# EAGLE design pico-v3 (EAGLE 9.6.2)
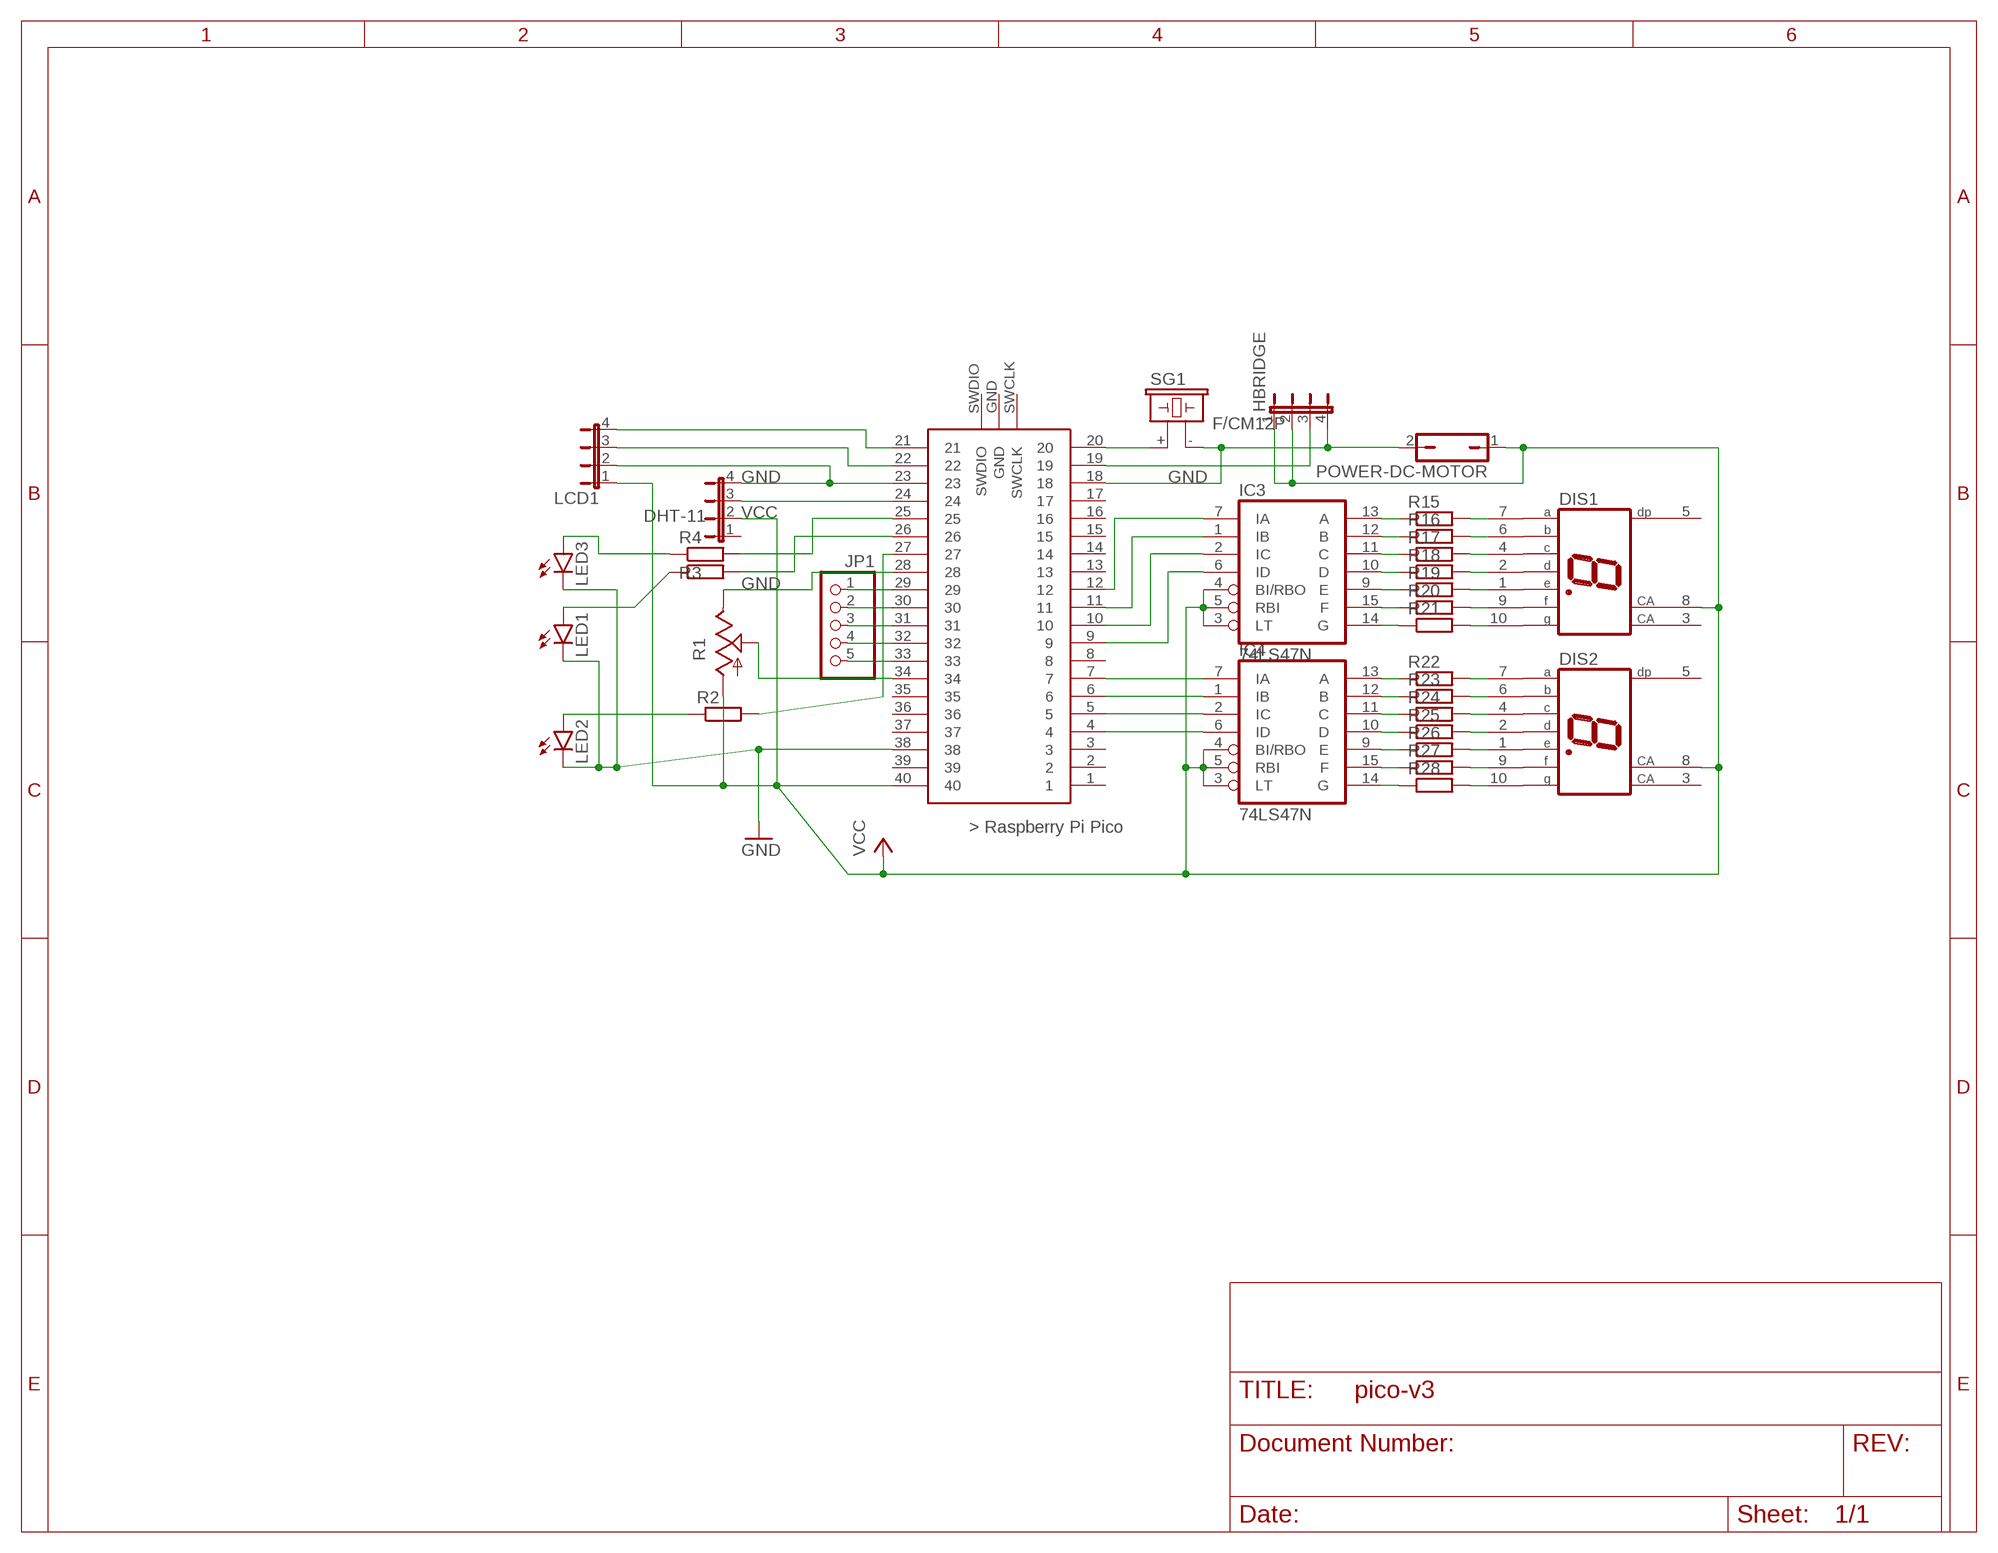
[diagram p0: schematic, sheet 1]

## Parts
DHT-11  JP4E  [JP4]
DIS1  HD-H101  [HDSP-M]
DIS2  HD-H101  [HDSP-M]
HBRIDGE  JP4E  [JP4]
IC3  74LS47N  [DIL16]
IC4  74LS47N  [DIL16]
JP1  PINHD-1X5  [1X05]
LCD1  JP4E  [JP4]
LED1  LED5MM  [LED5MM]
LED2  LED5MM  [LED5MM]
LED3  LED5MM  [LED5MM]
POWER-DC-MOTOR  JP1Q  [JP1]
R1  TRIM_US-CA6V  [CA6V]
R2  R-EU_0207/10  [0207/10]
R3  R-EU_0207/10  [0207/10]
R4  R-EU_0207/10  [0207/10]
R15  R-EU_0207/12  [0207/12]
R16  R-EU_0207/12  [0207/12]
R17  R-EU_0207/12  [0207/12]
R18  R-EU_0207/12  [0207/12]
R19  R-EU_0207/12  [0207/12]
R20  R-EU_0207/12  [0207/12]
R21  R-EU_0207/12  [0207/12]
R22  R-EU_0207/12  [0207/12]
R23  R-EU_0207/12  [0207/12]
R24  R-EU_0207/12  [0207/12]
R25  R-EU_0207/12  [0207/12]
R26  R-EU_0207/12  [0207/12]
R27  R-EU_0207/12  [0207/12]
R28  R-EU_0207/12  [0207/12]
SG1  F/CM12P  [F/CM12P]
U$1  RASPBERRY-PI-PICO_TH  [FT_RASPBERRY-PI-PICO_TH]

## Nets
GND: DHT-11.4 HBRIDGE.4 LCD1.2 LED1.K(C) LED2.K(C) LED3.K(C) POWER-DC-MOTOR.2 R1.E SG1.- U$1.18 U$1.23 U$1.28 U$1.38
N$1: IC4.7(IA) U$1.7
N$2: IC4.1(IB) U$1.6
N$3: IC4.2(IC) U$1.5
N$4: IC4.6(ID) U$1.4
N$5: R1.S U$1.34
N$6: IC3.14(G) R21.1
N$7: DIS2.7(A) R22.2
N$8: DIS2.6(B) R23.2
N$9: DIS2.4(C) R24.2
N$10: DIS2.2(D) R25.2
N$11: DIS2.1(E) R26.2
N$12: DIS1.10(G) R21.2
N$14: IC3.6(ID) U$1.9
N$15: IC3.2(IC) U$1.10
N$16: IC3.1(IB) U$1.11
N$17: IC3.7(IA) U$1.12
N$18: DIS2.9(F) R27.2
N$19: DIS2.10(G) R28.2
N$20: IC4.13(A) R22.1
N$21: IC4.12(B) R23.1
N$22: IC4.11(C) R24.1
N$23: DIS1.7(A) R15.2
N$24: DIS1.6(B) R16.2
N$25: DIS1.4(C) R17.2
N$26: DIS1.2(D) R18.2
N$27: DIS1.1(E) R19.2
N$28: JP1.1 U$1.29
N$29: JP1.2 U$1.30
N$30: IC4.10(D) R25.1
N$31: IC4.9(E) R26.1
N$32: IC4.15(F) R27.1
N$33: IC4.14(G) R28.1
N$34: SG1.+ U$1.20
N$35: JP1.3 U$1.31
N$36: DIS1.9(F) R20.2
N$37: IC3.13(A) R15.1
N$38: IC3.12(B) R16.1
N$39: IC3.11(C) R17.1
N$40: IC3.10(D) R18.1
N$41: IC3.9(E) R19.1
N$42: IC3.15(F) R20.1
N$43: HBRIDGE.3 U$1.19
N$44: JP1.4 U$1.32
N$45: DHT-11.3 U$1.24
N$46: LCD1.4 U$1.21
N$47: LCD1.3 U$1.22
N$48: JP1.5 U$1.33
N$51: R2.2 U$1.27
N$52: R4.2 U$1.25
N$53: R3.2 U$1.26
N$54: LED2.A R2.1
N$55: LED1.A R3.1
N$56: LED3.A R4.1
VCC [New Class]: DHT-11.2 DIS1.8(CA) DIS2.8(CA) HBRIDGE.1 HBRIDGE.2 IC3.3(LT) IC3.4(BI/RBO) IC3.5(RBI) IC4.3(LT) IC4.4(BI/RBO) IC4.5(RBI) LCD1.1 POWER-DC-MOTOR.1 R1.A U$1.40
Unconnected: DHT-11.1 DIS1.3(CA) DIS1.5(DP) DIS2.3(CA) DIS2.5(DP) U$1.1 U$1.2 U$1.3 U$1.8 U$1.13 U$1.14 U$1.15 U$1.16 U$1.17 U$1.35 U$1.36 U$1.37 U$1.39 U$1.GND U$1.SWCLK U$1.SWDIO

## Power pins joined to a net without a drawn wire
GND: IC3.8(GND) IC4.8(GND)
VCC: IC3.16(VCC) IC4.16(VCC)

## Library data of the parts
DHT-11 HBRIDGE LCD1 = jumper:JP4E: JUMPER
DIS1 DIS2 = display-hp:HD-H101: LED DISPLAY 1-character 7 segment, decimal point right; OC_FARNELL: unknown; OC_NEWARK: unknown
IC3 IC4 = 74xx-eu:74*47: BCD to seven segment DECODER/DRIVER Source: http://www.ee.washington.edu/stores/DataSheets/74ls/74ls47.pdf
JP1 = pinhead:PINHD-1X5: PIN HEADER
LED1-LED3 = led:LED: LED OSRAM: - CHIPLED LG R971, LG N971, LY N971, LG Q971, LY Q971, LO R971, LY R971 LH N974, LH R974 LS Q976, LO Q976, LY Q976 LO Q996 - Hyper CHIPLED LW Q18S LB Q993, LB Q99A, LB R99A - SideLED LS A670, LO A670, LY A670, LG A670, LP A670 LB A673, LV A673, LT A673, LW A673 LH A674 LY A675 LS A676, LA A676, LO A676, LY A676, LW A676 LS A679, LY A679, LG A679 - Hyper Micro SIDELED® LS Y876, LA Y876, LO Y876, LY Y876 LT Y87S - SmartLED LW L88C, LW L88S LB L89C, LB L89S, LG L890 LS L89K, LO L89K, LY L89K LS L896, LA L896, LO L896, LY L896 - TOPLED LS T670, LO T670, LY T670, LG T670, LP T670 LSG T670, LSP T670, LSY T670, LOP T670, LYG T670 LG T671, LOG T671, LSG T671 LB T673, LV T673, LT T673, LW T673 LH T674 LS T676, LA T676, LO T676, LY T676, LB T676, LH T676, LSB T676, LW T676 LB T67C, LV T67C, LT T67C, LS T67K, LO T67K, LY T67K, LW E67C LS E67B, LA E67B, LO E67B, LY E67B, LB E67C, LV E67C, LT E67C LW T67C LS T679, LY T679, LG T679 LS T770, LO T770, LY T770, LG T770, LP T770 LB T773, LV T773, LT T773, LW T773 LH T774 LS E675, LA E675, LY E675, LS T675 LS T776, LA T776, LO T776, LY T776, LB T776 LHGB T686 LT T68C, LB T68C - Hyper Mini TOPLED® LB M676 - Mini TOPLED Santana® LG M470 LS M47K, LO M47K, LY M47K Source: http://www.osram.convergy.de LUXEON: - LUMILED® LXK2-PW12-R00, LXK2-PW12-S00, LXK2-PW14-U00, LXK2-PW14-V00 LXK2-PM12-R00, LXK2-PM12-S00, LXK2-PM14-U00 LXK2-PE12-Q00, LXK2-PE12-R00, LXK2-PE12-S00, LXK2-PE14-T00, LXK2-PE14-U00 LXK2-PB12-K00, LXK2-PB12-L00, LXK2-PB12-M00, LXK2-PB14-N00, LXK2-PB14-P00, LXK2-PB14-Q00 LXK2-PR12-L00, LXK2-PR12-M00, LXK2-PR14-Q00, LXK2-PR14-R00 LXK2-PD12-Q00, LXK2-PD12-R00, LXK2-PD12-S00 LXK2-PH12-R00, LXK2-PH12-S00 LXK2-PL12-P00, LXK2-PL12-Q00, LXK2-PL12-R00 Source: www.luxeon.com KINGBRIGHT: KA-3528ASYC Source: www.kingbright.com
POWER-DC-MOTOR = jumper:JP1Q: JUMPER
R1 = pot:TRIM_US-: POTENTIOMETER
R2-R4 R15-R28 = rcl:R-EU_: RESISTOR, European symbol; SPICEPREFIX: R
SG1 = buzzer:F/CM12P: BUZZER Source: Buerklin; OC_FARNELL: unknown; OC_NEWARK: unknown
U$1 = pipico:RASPBERRY-PI-PICO_TH: Raspberry Pi Pico microcontroller board for through-hole mounting.

## Board
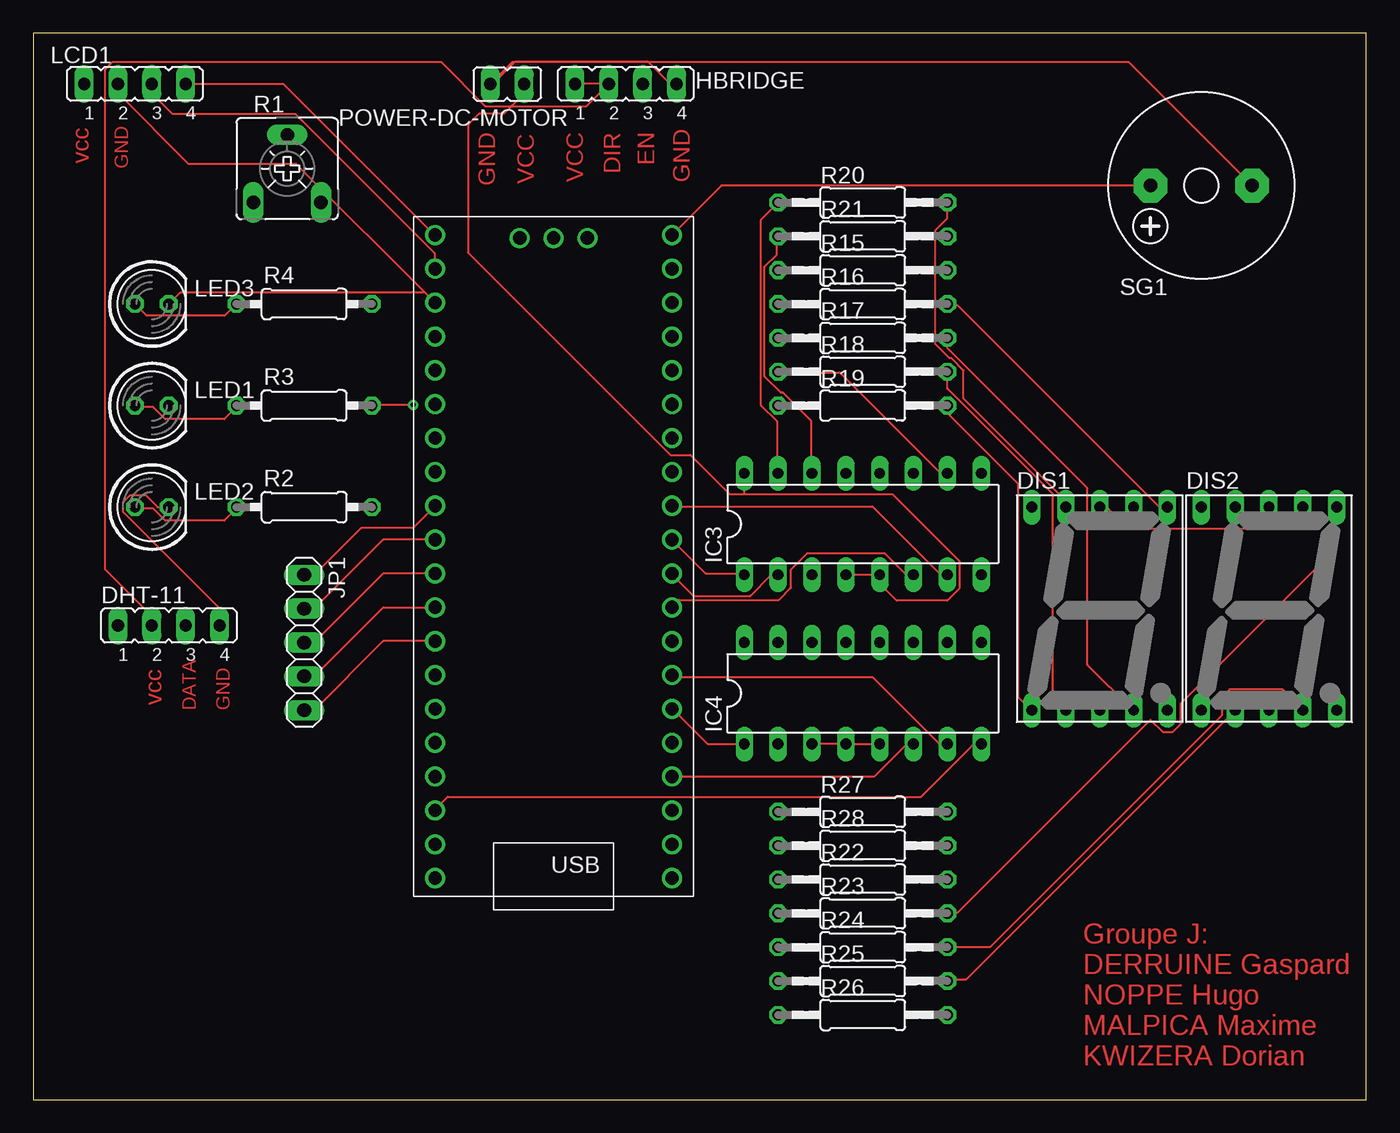
[diagram p1: board, top side]
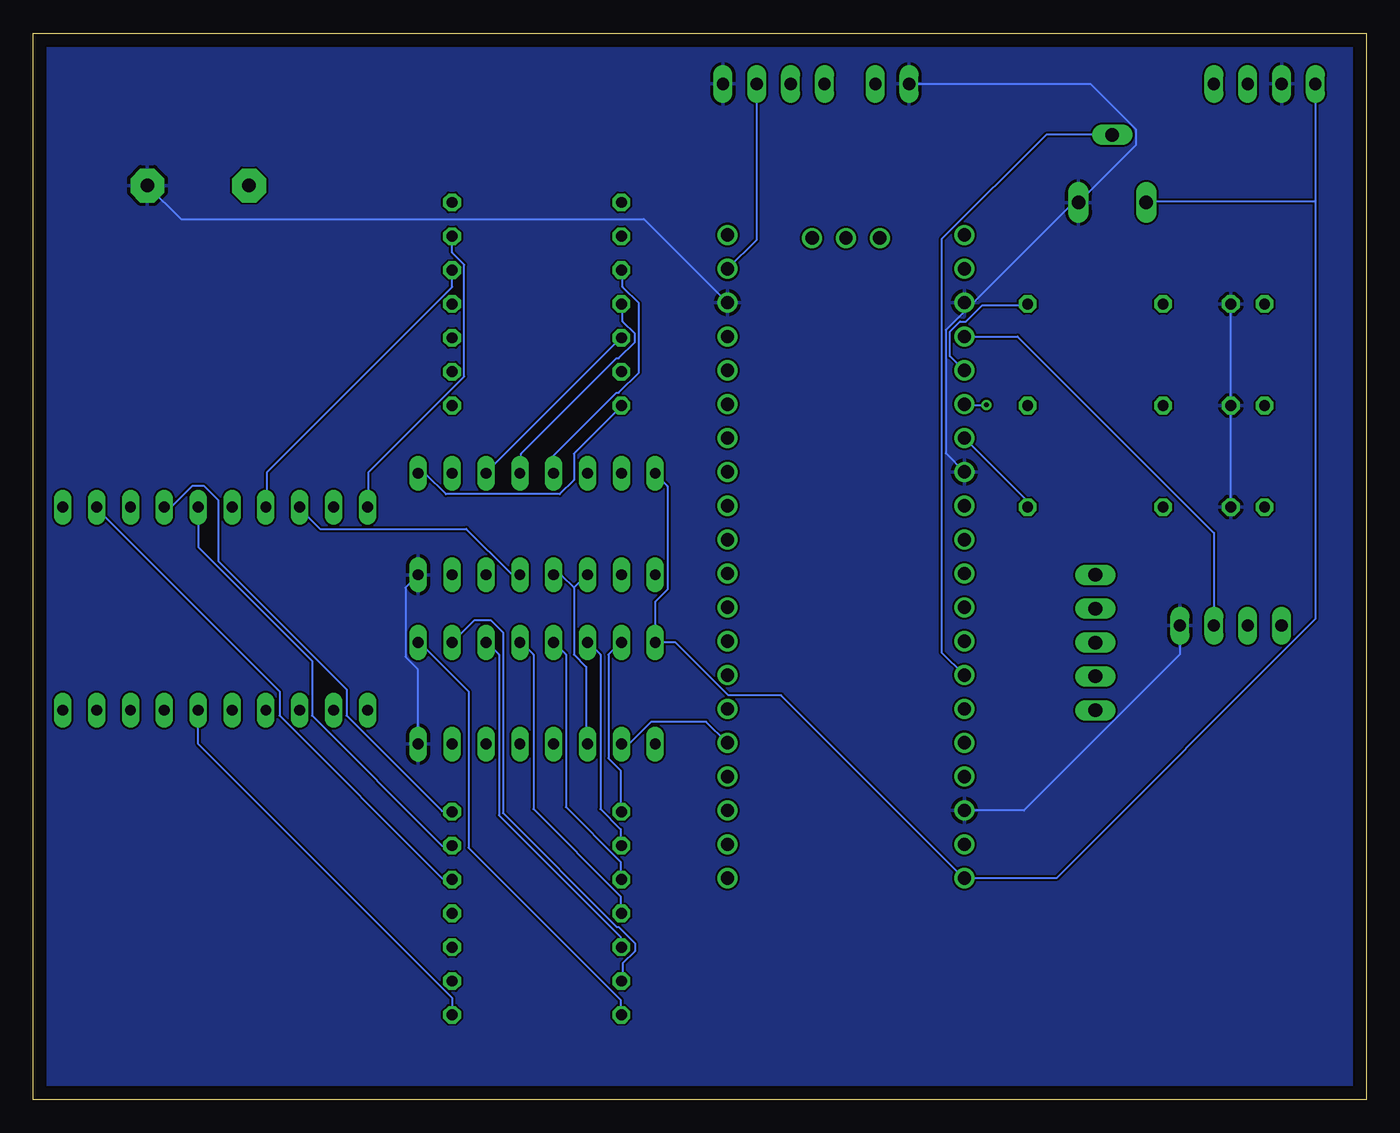
[diagram p2: board, bottom side, seen from below]

Size 100 x 80 mm. Coordinates in mm from the lower left corner, seen from the top.
Outline: 0,0 100,0 100,80 0,80 0,0
Copper layers (1*16): Top 0.035mm / dielectric 1.5mm / Bottom 0.035mm
Design rules "default": minimum track width 6mil, minimum drill 0.35mm, track to track 6mil, track to pad 6mil, pad to pad 6mil, via to via 6mil, smd to smd 6mil, copper to edge 40mil, drill to drill 6mil, minimum pad ring 10mil, minimum via ring 8mil, stop-mask expansion 4mil, vias tented up to drill 0mil, thermal gap 10mil

### Footprints (pad centres in the part's own frame; a part is rotated, then mirrored left to right if it is on the bottom)
JP4 = drill 0.914 long: 1 -3.81,0; 2 -1.27,0; 3 1.27,0; 4 3.81,0
HDSP-M = drill 0.813 long: 1 -5.08,-7.62; 2 -2.54,-7.62; 3 0,-7.62; 4 2.54,-7.62; 5 5.08,-7.62; 6 5.08,7.62; 7 2.54,7.62; 8 0,7.62; 9 -2.54,7.62; 10 -5.08,7.62
DIL16 = drill 0.813 long: 1 -8.89,-3.81; 2 -6.35,-3.81; 3 -3.81,-3.81; 4 -1.27,-3.81; 5 1.27,-3.81; 6 3.81,-3.81; 7 6.35,-3.81; 8 8.89,-3.81; 9 8.89,3.81; 10 6.35,3.81; 11 3.81,3.81; 12 1.27,3.81; 13 -1.27,3.81; 14 -3.81,3.81; 15 -6.35,3.81; 16 -8.89,3.81
1X05 = drill 1.016 long: 1 -5.08,0; 2 -2.54,0; 3 0,0; 4 2.54,0; 5 5.08,0
LED5MM = drill 0.813 octagon: A -1.27,0; K 1.27,0
JP1 = drill 0.914 long: 1 0,-1.27; 2 0,1.27
CA6V = drill 1.016 long: A -2.54,-2.54; E 2.54,-2.54; S 0,2.54
0207/10 = drill 0.813 octagon: 1 -5.08,0; 2 5.08,0
0207/12 = drill 0.813 octagon: 1 -6.35,0; 2 6.35,0
F/CM12P = drill 1.016 pad 2.54 octagon: + 3.81,0; - -3.81,0
FT_RASPBERRY-PI-PICO_TH = drill 1: 1 -8.55,24.03; 2 -8.55,21.49; 3 -8.55,18.95; 4 -8.55,16.41; 5 -8.55,13.87; 6 -8.55,11.33; 7 -8.55,8.79; 8 -8.55,6.25; 9 -8.55,3.71; 10 -8.55,1.17; 11 -8.55,-1.37; 12 -8.55,-3.91; 13 -8.55,-6.45; 14 -8.55,-8.99; 15 -8.55,-11.53; 16 -8.55,-14.07; 17 -8.55,-16.61; 18 -8.55,-19.15; 19 -8.55,-21.69; 20 -8.55,-24.23; 21 9.23,-24.23; 22 9.23,-21.69; 23 9.23,-19.15; 24 9.23,-16.61; 25 9.23,-14.07; 26 9.23,-11.53; 27 9.23,-8.99; 28 9.23,-6.45; 29 9.23,-3.91; 30 9.23,-1.37; 31 9.23,1.17; 32 9.23,3.71; 33 9.23,6.25; 34 9.23,8.79; 35 9.23,11.33; 36 9.23,13.87; 37 9.23,16.41; 38 9.23,18.95; 39 9.23,21.49; 40 9.23,24.03; GND 0.34,-24; SWCLK -2.2,-24; SWDIO 2.88,-24

### Placement (x,y rotation side)
DHT-11  10.16,35.56 0 top
DIS1  80.01,36.83 0 top
DIS2  92.71,36.83 0 top
HBRIDGE  44.45,76.2 0 top
IC3  62.23,43.18 0 top
IC4  62.23,30.48 0 top
JP1  20.32,34.29 270 top
LCD1  7.62,76.2 0 top
LED1  8.89,52.07 0 top
LED2  8.89,44.45 0 top
LED3  8.89,59.69 0 top
POWER-DC-MOTOR  35.56,76.2 90 top
R1  19.05,69.85 0 top
R2  20.32,44.45 0 top
R3  20.32,52.07 0 top
R4  20.32,59.69 0 top
R15  62.23,62.23 0 top
R16  62.23,59.69 0 top
R17  62.23,57.15 0 top
R18  62.23,54.61 0 top
R19  62.23,52.07 0 top
R20  62.23,67.31 0 top
R21  62.23,64.77 0 top
R22  62.23,16.51 0 top
R23  62.23,13.97 0 top
R24  62.23,11.43 0 top
R25  62.23,8.89 0 top
R26  62.23,6.35 0 top
R27  62.23,21.59 0 top
R28  62.23,19.05 0 top
SG1  87.63,68.58 180 top
U$1  39.37,40.64 180 top

### Tracks (layer width: path | path; a pad name or v marks a point on that pad's centre or on a via)
GND
  Top 0.152: IC4.8 70.56,26.67 66.6,22.71 31.09,22.71 30.18,21.79 U$1.38 | LED2.K 9.32,44.45 8.43,45.34 7.25,45.34 6.73,44.82 6.73,44.08 13.97,36.84 DHT-11.4 | HBRIDGE.4 47.76,76.2 46.11,77.85 36.13,77.85 34.48,76.2 POWER-DC-MOTOR.2 35.94,77.85 82.17,77.85 SG1.- | LCD1.2 6.35,75.49 11.61,70.23 19.7,70.23 U$1.23 29.35,60.58 11.05,60.58 LED3.K
  Bottom 0.152: IC3.8 72.08,38.41 72.08,33.22 71.17,32.31 71.17,26.67 IC4.8 | LED2.K 10.21,44.5 10.21,51.97 LED1.K LED3.K | SG1.- 88.92,66.06 54.19,66.06 U$1.18 | POWER-DC-MOTOR.2 20.7,76.2 17.3,72.8 17.3,71.6 R1.E 21.97,67.31 29.82,59.46 | U$1.28 31.55,48.5 31.55,57.73 29.82,59.46 | 29.82,59.46 30.1,59.74 U$1.23 | DHT-11.4 13.97,34.85 13.97,33.4 25.68,21.69 U$1.38
  pour Bottom (isolate 0.021): 0,80.01 100.33,80.01 100.33,0 0,0
N$1
  Top 0.152: IC4.7 67.97,26.67 62.94,31.7 48.01,31.7 U$1.7
N$2
  Top 0.152: IC4.1 50.6,26.67 48.01,29.26 U$1.6
N$3
  Bottom 0.152: IC4.2 55.32,26.67 53.65,28.35 49.53,28.35 48.01,26.82 U$1.5
N$4
  Top 0.152: IC4.6 65.53,26.67 63.09,24.23 48.01,24.23 U$1.4
N$5
  Bottom 0.152: R1.S 24.01,72.39 31.85,64.55 31.85,33.56 U$1.34
N$6
  Top 0.152: R21.1 55.78,64.77 55.78,63.4 54.86,62.48 54.86,54.25 56.08,53.03 56.24,53.03 58.37,50.9 58.37,47.09 IC3.14
N$7
  Bottom 0.152: R22.2 68.58,16.61 69.34,16.61 81.53,28.8 81.53,30.63 95.25,44.35 DIS2.7
N$8
  Top 0.152: DIS2.6 97.69,44.35 97.69,41.3 86.11,29.72 86.11,28.19 85.5,27.58 84.73,27.58 83.82,28.5 69.34,14.02 68.63,14.02 R23.2
N$9
  Top 0.152: R24.2 71.78,11.43 89.15,28.8 89.15,30.18 89.76,30.79 93.73,30.79 95.25,29.26 DIS2.4
N$10
  Top 0.152: R25.2 68.58,8.99 69.95,8.99 DIS2.2
N$11
  Bottom 0.152: R26.2 68.58,7.62 87.63,26.67 DIS2.1
N$12
  Bottom 0.152: R21.2 68.58,63.55 67.67,62.64 67.67,54.25 74.83,47.09 74.83,44.5 DIS1.10
N$14
  Top 0.152: IC3.6 65.99,39.47 65.38,39.47 63.86,41 58.06,41 56.84,39.78 56.84,38.41 55.93,37.49 48.46,37.49 48.01,37.03 U$1.9
N$15
  Top 0.152: IC3.2 55.78,39.32 55.32,39.32 53.8,37.8 49.53,37.8 48.01,39.32 U$1.10
N$16
  Top 0.152: IC3.1 53.34,39.47 50.44,39.47 48.01,41.91 U$1.11
N$17
  Top 0.152: IC3.7 68.58,39.47 67.97,39.47 62.94,44.5 48.01,44.5 U$1.12
N$18
  Bottom 0.152: R27.2 68.58,21.64 69.34,21.64 76.5,28.8 76.5,30.79 86.11,40.39 86.11,44.96 87.17,46.02 88.09,46.02 89.61,44.5 90.07,44.5 DIS2.9
N$19
  Bottom 0.152: R28.2 69.34,19.05 79.1,28.8 79.1,32.92 87.63,41.45 DIS2.10
N$20
  Bottom 0.152: IC4.13 60.05,33.38 60.05,21.95 55.93,17.83 55.93,16.61 R22.1
N$21
  Bottom 0.152: R23.1 55.93,14.02 55.93,15.24 62.48,21.79 62.48,33.38 63.4,34.29 IC4.12
N$22
  Bottom 0.152: R24.1 55.93,11.43 55.93,12.19 65.08,21.34 65.08,33.38 65.99,34.29 IC4.11
N$23
  Bottom 0.152: R15.2 68.58,60.96 82.45,47.09 82.45,44.5 DIS1.7
N$24
  Top 0.152: R16.2 68.58,59.59 69.34,59.59 84.43,44.5 85.04,44.5 DIS1.6
N$25
  Top 0.152: R17.2 68.58,56.39 79.1,45.87 79.1,32.61 82.45,29.26 DIS1.4
N$26
  Top 0.152: R18.2 68.58,53.34 76.5,45.41 76.5,30.18 DIS1.2
N$27
  Top 0.152: R19.2 68.58,51.51 73.91,46.18 73.91,30.18 74.83,29.26 DIS1.1
N$28
  Top 0.152: U$1.29 28.49,42.9 24.61,42.9 21.08,39.37 JP1.1
N$29
  Top 0.152: U$1.30 26.26,42.01 21.08,36.83 JP1.2
N$30
  Bottom 0.152: IC4.10 66.9,35.97 65.68,35.97 64.77,35.05 64.77,21.49 56.24,12.95 56.08,12.95 54.86,11.73 54.86,11.12 55.78,10.21 55.78,8.99 R25.1
N$31
  Bottom 0.152: R26.1 55.93,6.4 55.93,7.47 67.36,18.9 67.36,30.63 71.02,34.29 IC4.9
N$32
  Bottom 0.152: R27.1 55.93,21.64 55.93,24.69 56.84,25.6 56.84,33.38 55.93,34.29 IC4.15
N$33
  Bottom 0.152: R28.1 55.93,19.05 55.93,20.27 57.45,21.79 57.45,33.38 58.37,34.29 IC4.14
N$34
  Top 0.152: SG1.+ 51.63,68.58 U$1.20
N$35
  Top 0.152: U$1.31 26.26,39.47 21.08,34.29 JP1.3
N$36
  Top 0.152: R20.2 68.58,66.14 67.67,65.23 67.67,56.69 68.73,55.63 68.89,55.63 69.8,54.71 69.8,52.58 77.42,44.96 77.42,44.5 DIS1.9
N$37
  Bottom 0.152: IC3.13 60.96,48.31 56.24,53.03 56.08,53.03 54.56,54.56 54.56,59.74 55.78,60.96 55.78,62.18 R15.1
N$38
  Bottom 0.152: R16.1 55.78,59.59 55.78,58.37 54.86,57.45 54.86,56.84 56.08,55.63 56.24,55.63 63.4,48.46 63.4,47.09 IC3.12
N$39
  Bottom 0.152: IC3.11 65.99,47.09 55.93,57.15 R17.1
N$40
  Top 0.152: IC3.10 68.58,47.09 67.97,47.09 60.5,54.56 55.93,54.56 R18.1
N$41
  Bottom 0.152: IC3.9 71.02,46.94 70.56,46.94 69.04,45.41 60.5,45.41 59.44,46.48 59.44,48.46 55.93,51.97 R19.1
N$42
  Top 0.152: R20.1 54.56,65.99 54.56,52.12 55.78,50.9 55.78,47.09 IC3.15
N$43
  Bottom 0.152: U$1.19 45.72,64.53 HBRIDGE.3
N$44
  Top 0.152: U$1.32 26.26,36.93 21.08,31.75 JP1.4
N$45
  Bottom 0.152: U$1.24 26.16,57.25 11.43,42.52 DHT-11.3
N$46
  Top 0.152: LCD1.4 18.75,76.2 30.02,64.92 U$1.21
N$47
  Top 0.152: U$1.22 30.14,63.46 19.66,73.94 10.44,73.94 8.89,75.49 LCD1.3
N$48
  Top 0.152: U$1.33 26.26,34.39 21.08,29.21 JP1.5
N$51
  Bottom 0.152: R2.2 25.45,44.5 25.45,44.96 30.02,49.53 U$1.27
N$52
  Bottom 0.152: R4.2 25.45,59.59 28.8,59.59 30.02,58.37 30.48,58.37 31.24,57.61 31.24,55.78 30.18,54.71 U$1.25
N$53  (via drill 0.35)
  Top 0.152: v28.5,52.12 25.45,52.12 R3.2
  Bottom 0.152: v28.5,52.12 30.02,52.12 U$1.26
N$54
  Top 0.152: LED2.A 7.62,44.35 8.99,44.35 9.91,43.43 14.33,43.43 15.24,44.35 R2.1
N$55
  Top 0.152: LED1.A 7.62,51.97 8.99,51.97 9.91,51.05 14.33,51.05 15.24,51.97 R3.1
N$56
  Top 0.152: R4.1 14.35,58.8 8.51,58.8 LED3.A
VCC
  Top 0.152: IC4.3 IC4.4 IC4.5 | HBRIDGE.1 HBRIDGE.2 41.5,74.52 35.97,74.52 35.94,74.55 | DIS1.8 80.01,44.35 80.62,44.35 82.14,42.82 91.14,42.82 92.66,44.35 DIS2.8 | 35.92,74.57 35.31,73.97 33.45,73.97 32.61,73.14 32.61,63.55 47.8,48.36 49.3,48.36 52.25,45.41 53.34,45.41 | 35.92,74.57 36.83,75.49 POWER-DC-MOTOR.1 | DHT-11.2 8.89,36.27 5.41,39.75 5.41,77.3 5.96,77.85 30.6,77.85 33.9,74.55 35.94,74.55 | 35.94,74.55 35.92,74.57 | 53.34,45.41 64.45,45.41 69.47,40.4 69.47,38.34 68.57,37.44 64.77,37.44 63.17,39.04 IC3.5 IC3.4 | 53.34,45.41 IC3.16
  Bottom 0.152: IC3.16 53.34,46.94 52.43,46.02 52.43,38.25 53.34,37.34 IC4.16 51.82,34.29 47.85,30.33 43.89,30.33 30.18,16.61 U$1.40 23.26,16.61 3.81,36.06 3.81,67.36 | LCD1.1 3.81,67.36 | 59.44,38.41 59.44,33.38 58.52,32.46 58.52,26.67 IC4.3 | 59.44,38.41 58.52,39.32 IC3.3 | 59.44,38.41 60.35,39.32 60.96,39.32 IC3.4 | IC3.5 63.55,39.47 64.16,39.47 67.51,42.82 78.49,42.82 80.01,44.35 DIS1.8 | 3.81,67.36 16.46,67.36 R1.A

### Text on the board
Top: vcc | GND | EN | GND | VCC | VCC | DIR | GND | vcc | DATA | GND | Groupe J: / DERRUINE Gaspard / NOPPE Hugo / MALPICA Maxime / KWIZERA Dorian